# Altium schematic sheet power.SchDoc: Your title
size A4; Date: 2017/06/29; DrawnBy: ØÁÔÀöÎ; Revision: Alfa 0.1; SheetNumber: 2; SheetTotal: 6; Time: 19:01
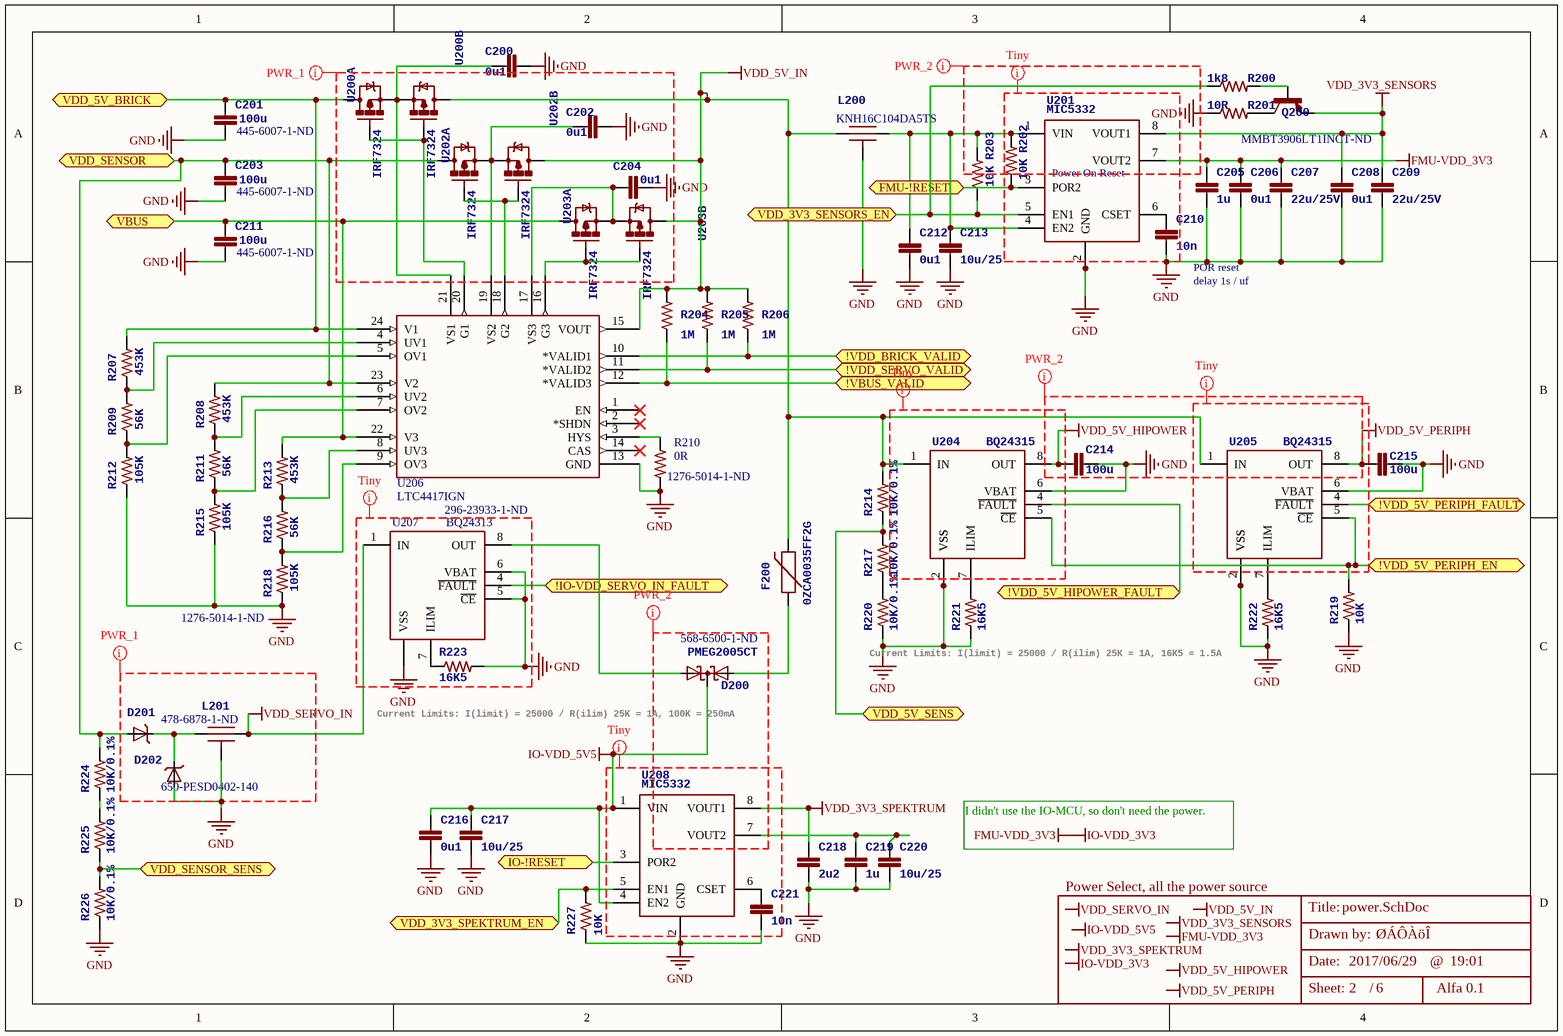
[diagram p0: power.SchDoc]

## Parts
C200  0u1  [0603-CAP]
C201  100u  Supplier Part Number 1: 445-6007-1-ND  [1206-CAP]
C202  0u1  [0603-CAP]
C203  100u  Supplier Part Number 1: 445-6007-1-ND  [1206-CAP]
C204  0u1  [0603-CAP]
C205  1u  [0603-CAP]
C206  0u1  [0603-CAP]
C207  22u/25V  [0805]
C208  0u1  [0603-CAP]
C209  22u/25V  [0805]
C210  10n  [0603-CAP]
C211  100u  Supplier Part Number 1: 445-6007-1-ND  [1206-CAP]
C212  0u1  [0603-CAP]
C213  10u/25  [0805]
C214  100u  [1206-CAP]
C215  100u  [1206-CAP]
C216  0u1  [0603-CAP]
C217  10u/25  [0805]
C218  2u2  [0603-CAP]
C219  1u  [0603-CAP]
C220  10u/25  [0805]
C221  10n  [0603-CAP]
D200  PMEG2005CT  Supplier Part Number 1: 568-6500-1-ND  [SOT23-3]
D201  DIODE-TVS  [0402-TVS]  (value not drawn)
D202  Supplier Part Number 1: 650-PESD0402-140  [0402-TVS]  (hidden comment: DIODE-TVS)
F200  0ZCA0035FF2G  [PTC-1206]
L200  Kyocera KNH16C104DA5TS EMI filter  [KYOCERA-KNH16-DA]  (value not drawn)
L201  Supplier Part Number 1: 478-6878-1-ND  [KYOCERA-KNH16-DA]  (hidden comment: Kyocera KNH16C104DA5TS EMI filter)
Q200  Supplier Part Number 1: MMBT3906LT1INCT-ND  [SOT23-BEC]  (hidden comment: MMBT3906*SMD)
R200  1k8  [0603-RES]
R201  10R  [0603-RES]
R202  10K  [0603-RES]
R203  10K  [0603-RES]
R204  1M  [0603-RES]
R205  1M  [0603-RES]
R206  1M  [0603-RES]
R207  453K  [0603-RES]
R208  453K  [0603-RES]
R209  56K  [0603-RES]
R210  0R  Supplier Part Number 1: 1276-5014-1-ND  [0603-RES]
R211  56K  [0603-RES]
R212  105K  [0603-RES]
R213  453K  [0603-RES]
R214  10K/0.1%  [0603-RES]
R215  105K  [0603-RES]
R216  56K  [0603-RES]
R217  10K/0.1%  [0603-RES]
R218  105K  Supplier Part Number 1: 1276-5014-1-ND  [0603-RES]
R219  10K  [0603-RES]
R220  10K/0.1%  [0603-RES]
R221  16K5  [0603-RES]
R222  16K5  [0603-RES]
R223  16K5  [0603-RES]
R224  10K/0.1%  [0603-RES]
R225  10K/0.1%  [0603-RES]
R226  10K/0.1%  [0603-RES]
R227  10K  [0603-RES]
U200  IRF7324  [SO08]  (parts A,B of 2)
U201  MIC5332  [MLF-8-EPAD]
U202  IRF7324  [SO08]  (parts A,B of 2)
U203  IRF7324  [SO08]  (parts A,B of 2)
U204  BQ24315  [QFN8-DSG]
U205  BQ24315  [QFN8-DSG]
U206  LTC4417IGN  [SSOP-24_GN]
U207  BQ24313  Supplier Part Number 1: 296-23933-1-ND  [QFN8-DSG]
U208  MIC5332  [MLF-8-EPAD]

## Ports
!IO-VDD_SERVO_IN_FAULT, !VBUS_VALID, !VDD_5V_HIPOWER_FAULT, !VDD_5V_PERIPH_EN, !VDD_5V_PERIPH_FAULT, !VDD_BRICK_VALID, !VDD_SERVO_VALID, FMU-!RESET, IO-!RESET, VBUS, VDD_3V3_SENSORS_EN, VDD_3V3_SPEKTRUM_EN, VDD_5V_BRICK, VDD_5V_SENS, VDD_SENSOR, VDD_SENSOR_SENS

## Nets
FMU-VDD_3V3: C205.P$1 C206.P$1 C207.1 U201.7(VOUT2)  [also labelled IO-VDD_3V3]
GND: C200.P$1 C201.P$2 C202.P$1 C203.P$2 C204.P$1 C205.P$2 C206.P$2 C207.2 C208.P$2 C209.2 C210.P$2 C211.P$2 C212.P$2 C213.2 C214.P$2 C215.P$2 C216.P$2 C217.2 C218.P$2 C219.P$2 C220.2 C221.P$2 D202.A L200.GND L201.GND R201.1 R210.1 R212.1 R215.1 R218.1 R219.1 R220.1 R221.1 R222.1 R223.2 R226.1 R227.1 U201.2(GND) U201.GND U204.2(VSS) U204.6(VBAT) U204.GND(VSS) U205.2(VSS) U205.6(VBAT) U205.GND(VSS) U206.13(GND) U207.2(VSS) U207.5(~{CE}) U207.6(VBAT) U207.GND(VSS) U208.2(GND) U208.GND
IO-VDD_5V5: C216.P$1 C217.1 D200.3(CC) U208.1(VIN) U208.4(EN2)
VDD_3V3_SENSORS: C208.P$1 C209.1 Q200.E U201.8(VOUT1)
VDD_3V3_SPEKTRUM: C218.P$1 U208.8(VOUT1)
VDD_5V_HIPOWER: C214.P$1 U204.8(OUT)
VDD_5V_IN: F200.2 L200.P$1 R204.2 R205.2 R206.2 R214.2 U200.5(D) U202.5(D) U203.5(D) U204.1(IN) U205.1(IN) U206.15(VOUT)
VDD_5V_PERIPH: C215.P$1 U205.8(OUT)
VDD_SERVO_IN: L201.P$2 U207.1(IN)
!IO-VDD_SERVO_IN_FAULT: U207.4(~{FAULT}) ; port !IO-VDD_SERVO_IN_FAULT
!VBUS_VALID: R204.1 U206.12(*VALID3) ; port !VBUS_VALID
!VDD_5V_HIPOWER_FAULT: U204.4(~{FAULT}) ; port !VDD_5V_HIPOWER_FAULT
!VDD_5V_PERIPH_EN: R219.2 U204.5(~{CE}) U205.5(~{CE}) ; port !VDD_5V_PERIPH_EN
!VDD_5V_PERIPH_FAULT: U205.4(~{FAULT}) ; port !VDD_5V_PERIPH_FAULT
!VDD_BRICK_VALID: R206.1 U206.10(*VALID1) ; port !VDD_BRICK_VALID
!VDD_SERVO_VALID: R205.1 U206.11(*VALID2) ; port !VDD_SERVO_VALID
FMU-!RESET: R202.1 U201.3(POR2) ; port FMU-!RESET
IO-!RESET: U208.3(POR2) ; port IO-!RESET
VBUS: C211.P$1 R213.2 U203.7(D) U206.22(V3) ; port VBUS
VDD_3V3_SENSORS_EN: R200.1 R203.1 U201.5(EN1) ; port VDD_3V3_SENSORS_EN
VDD_3V3_SPEKTRUM_EN: R227.2 U208.5(EN1) ; port VDD_3V3_SPEKTRUM_EN
VDD_5V_BRICK: C201.P$1 R207.2 U200.7(D) U206.24(V1) ; port VDD_5V_BRICK
VDD_5V_SENS: R214.1 R217.2 ; port VDD_5V_SENS
VDD_SENSOR: C203.P$1 D201.A R208.2 R224.2 U202.7(D) U206.23(V2) ; port VDD_SENSOR
VDD_SENSOR_SENS: R225.1 R226.2 ; port VDD_SENSOR_SENS
NetC200_P$2: C200.P$2 U200.1(S) U200.3(S) U206.21(VS1)
NetC202_P$2: C202.P$2 U202.1(S) U202.3(S) U206.19(VS2)
NetC204_P$2: C204.P$2 U203.1(S) U203.3(S) U206.17(VS3)
NetC210_P$1: C210.P$1 U201.6(CSET)
NetC212_P$1: C212.P$1 C213.1 L200.P$2 R202.2 R203.2 U201.1(VIN) U201.4(EN2)
NetC219_P$1: C219.P$1 C220.1 U208.7(VOUT2)
NetC221_P$1: C221.P$1 U208.6(CSET)
NetD200_1: D200.1(A1) F200.1
NetD200_2: D200.2(A2) U207.8(OUT)
NetD201_C: D201.C D202.C L201.P$1
NetQ200_B: Q200.B R200.2
NetQ200_C: Q200.C R201.2
NetR207_1: R207.1 R209.2 U206.4(UV1)
NetR208_1: R208.1 R211.2 U206.6(UV2)
NetR209_1: R209.1 R212.2 U206.5(OV1)
NetR210_2: R210.2 U206.3(HYS)
NetR211_1: R211.1 R215.2 U206.7(OV2)
NetR213_1: R213.1 R216.2 U206.8(UV3)
NetR216_1: R216.1 R218.2 U206.9(OV3)
NetR217_1: R217.1 R220.2
NetR221_2: R221.2 U204.7(ILIM)
NetR222_2: R222.2 U205.7(ILIM)
NetR223_1: R223.1 U207.7(ILIM)
NetR224_1: R224.1 R225.2
NetU200_2: U200.2(G) U200.4(G) U206.20(G1)
NetU202_2: U202.2(G) U202.4(G) U206.18(G2)
NetU203_2: U203.2(G) U203.4(G) U206.16(G3)

Not connected (* = marked no-connect by the designer): U206 1(EN)* 2(*SHDN)* 14(CAS)*

## Layout directives
net class PWR1_NetClass; rule Width Constraint [Pref Width = 30mil    Min Width = 10mil    Max Width = 60mil]: GND, VDD_SERVO_IN
net class PWR2_NetClass; rule Width Constraint [Pref Width = 20mil    Min Width = 10mil    Max Width = 30mil]: (no net found under the mark), GND, VDD_5V_HIPOWER, VDD_5V_PERIPH
net class Tiny_componet: (no net found under the mark), GND, VDD_5V_HIPOWER, VDD_5V_PERIPH

## Notes on the sheet
- (near U201) Power On Reset
- (near C210) POR reset
- delay 1s / uf
- Current Limits:
  I(limit) = 25000 / R(ilim)
  25K = 1A, 16K5 = 1.5A
- Current Limits:
  I(limit) = 25000 / R(ilim)
  25K = 1A, 100K = 250mA
- I didn't use the IO-MCU, so don't need the power.
- Power Select, all the power source
- Labels drawn without touching a wire or pin: FMU-VDD_3V3, IO-VDD_3V3, IO-VDD_5V5, VDD_3V3_SENSORS, VDD_3V3_SPEKTRUM, VDD_5V_HIPOWER, VDD_5V_IN, VDD_5V_PERIPH, VDD_SERVO_IN
- Title:
- Date:
- Drawn by:
- @
- Sheet:       /

## Library data of the parts
C200 C202 C204-C206 C208 C210 C212 C216 C218 C219 C221 = CAP0603: CAP CER 2.2UF 16V 10% X6S 0603; PARTNO: C1608X6S1C225K080AC; 3DR_PARTNO: ECM0619; Supplier 1: Digi-Key; Supplier Part Number 1: 445-7438-1-ND
  C200 C202 C204 C206 C208 C212 C216: Value: 0u1
  C205 C219: Value: 1u
  C210 C221: Value: 10n
  C218: Value: 2u2
C201 C203 C211 C214 C215 = CAP1206: CAP CER 100UF 10V 20% X5R 1206; PARTNO: C3216X5R1A107M160AC; 3DR_PARTNO: ECM0716; Supplier 1: Digi-Key; Value: 100U
  C214 C215: Supplier Part Number 1: 445-6007-1-ND
C207 C209 C213 C217 C220 = CAP0805: CAP CER 4.7UF 16V 10% X7R 0805; PARTNO: CL21B475KOFNNNE; 3DR_PARTNO: ECM0622; DATASHEET: http://www.digikey.com/product-detail/en/CL21B475KOFNNNE/1276-2873-2-ND/3888531; Supplier 1: Digi-Key; Supplier Part Number 1: 1276-2873-1-ND
  C207 C209: Value: 22u/25V
  C213 C217 C220: Value: 10u/25
D200 = PMEG2005CT: DIODE SCHOTTKY 20V 500MA TO236AB; 3DR_PARTNO: ECM0838; PARTNO: PMEG2005CT; Supplier 1: Digi-Key; Value: 20V
D201 D202 = DIODE-TVS: TVS DIODE 14VWM 40VC 0402; 3DR_PARTNO: ECM0837; PARTNO: PESD0402-140; Value: 40v; Supplier 1: Mouser
  D201: Supplier Part Number 1: 650-PESD0402-140
F200 = PTCSMD: PTC RESTTBLE 0.35A 16V CHIP 1206; 3DR_PARTNO: ECM0802; PARTNO: 0ZCA0035FF2G; Supplier 1: Digi-Key; Supplier Part Number 1: 507-1479-1-ND; Value: 0.35A
L200 L201 = KNH16C104DA5TS: FILTER CAP 0.1UF 2A 25V 0603; 3DR_PARTNO: ECM0719; Value: 0u1; Supplier 1: Digi-Key; PARTNO: KNH16C104DA5TS
  L200: Supplier Part Number 1: 478-6878-1-ND
Q200 = MMBT3906*SMD: TRANSISTOR SWITCHING PNP SOT-23; 3DR_PARTNO: ECM0833; PARTNO: MMBT 3906 LT1; Supplier 1: Digi-Key
R200-R209 R211-R227 = RESISTOR0603-RES: RES 10 OHM 1/10W 5% 0603; PARTNO: RC1608J100CS; 3DR_PARTNO: ECM0811; Supplier 1: Digi-Key
  R200: Supplier Part Number 1: 1276-5014-1-ND; Value: 1k8
  R201: Supplier Part Number 1: 1276-5014-1-ND; Value: 10R
  R202 R203 R219 R227: Supplier Part Number 1: 1276-5014-1-ND; Value: 10K
  R204-R206: Supplier Part Number 1: 1276-5014-1-ND; Value: 1M
  R207 R208 R213: Supplier Part Number 1: 1276-5014-1-ND; Value: 453K
  R209 R211 R216: Supplier Part Number 1: 1276-5014-1-ND; Value: 56K
  R212 R215: Supplier Part Number 1: 1276-5014-1-ND; Value: 105K
  R214 R217 R220 R224-R226: Supplier Part Number 1: 1276-5014-1-ND; Value: 10K/0.1%
  R218: Value: 105K
  R221-R223: Supplier Part Number 1: 1276-5014-1-ND; Value: 16K5
R210 = RESISTOR0603-RES: RES 10 OHM 1/10W 5% 0603; PARTNO: RC1608J100CS; 3DR_PARTNO: ECM0811; Value: 10R; Supplier 1: Digi-Key
U200 U202 U203 = PMOSFET-DUAL: MOSFET 2P-CH 20V 2.9A CHIPFET; 3DR_PARTNO: EMC0901; Supplier 1: Digi-Key; Supplier 2: Mouser; Value: 20V 2.9A
U201 U208 = MIC5332: IC REG LDO 3.3V 0.3A 8TMLF; 3DR_PARTNO: ECM0832; PARTNO: MIC5332-SSYMT TR; Supplier 1: Digi-Key; Supplier Part Number 1: 576-4110-1-ND; Value: 3.3V
U204 U205 = BQ24315: IC LI+ CHARGER FRONT END 8SON; 3DR_PARTNO: ECM0541; Value: 3.3V-30V; Supplier 1: Digi-Key; Supplier Part Number 1: 296-32030-1-ND
U206 = LTC4417IGN#TRPBF: Selects Highest Priority Supply from Three Inputs; Vendor: Linear Technology; Manufacturer_Part_Number: ltc4417ign#trpbf; Value: Value; Type: Type; RefDes: RefDes
U207 = BQ24313: IC LI+ CHARGER FRONT END 8-SON; 3DR_PARTNO: ECM0824; PARTNO: BQ24313DSGT; Supplier 1: Digi-Key